# Altium schematic sheet Connectors.SchDoc
size A4; SheetNumber: 3; SheetTotal: 4
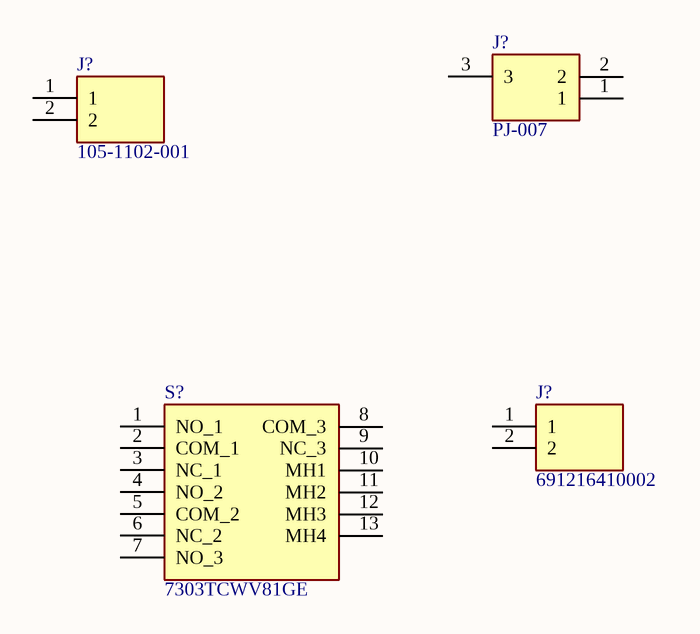
[diagram p0: Connectors.SchDoc]

## Parts
(Parts that share a designator on the sheet are numbered #1, #2 ... from top to bottom, then left to right.)
J?#1  PJ-007  [PJ007]
J?#2  105-1102-001  [1051102001]
J?#3  691216410002  [691216410002]
S?  7303TCWV81GE  [7303TCWV81GE]

## Nets

Not connected (* = marked no-connect by the designer): J?#1 1 2 3; J?#2 1 2; J?#3 1 2; S? 1(NO_1) 2(COM_1) 3(NC_1) 4(NO_2) 5(COM_2) 6(NC_2) 7(NO_3) 8(COM_3) 9(NC_3) 10(MH1) 11(MH2) 12(MH3) 13(MH4)

## Library data of the parts
J?#1 = PJ-007: Connector; Manufacturer_Name: Same Sky; Datasheet Link: https://www.sameskydevices.com/product/resource/supplyframepdf/pj-007.pdf; Height: 7.6mm; Manufacturer_Part_Number: PJ-007; Mouser Part Number: 490-PJ-007; Mouser Price/Stock: https://www.mouser.co.uk/ProductDetail/CUI-Devices/PJ-007?qs=WyjlAZoYn52tkNApkXGfYg%3D%3D; Arrow Part Number: PJ-007; Arrow Price/Stock: https://www.arrow.com/en/products/pj-007/cui-devices?region=nac
J?#2 = 105-1102-001: Connector; Manufacturer_Name: Cinch Connectivity Solutions; Datasheet Link: https://www.mouser.com/datasheet/2/643/pi-CCS-JOHN-105-1102-001-1289590.pdf; Height: 5.16mm; Manufacturer_Part_Number: 105-1102-001; Mouser Part Number: 530-105-1102-1; Mouser Price/Stock: https://www.mouser.co.uk/ProductDetail/Johnson-Cinch-Connectivity-Solutions/105-1102-001?qs=ALatB1zlu3CDNmlfAzCZwg%3D%3D; Arrow Part Number: 105-1102-001; Arrow Price/Stock: https://www.arrow.com/en/products/105-1102-001/cinch-connectivity-solutions?region=nac
J?#3 = 691216410002: Connector; Manufacturer_Name: Wurth Elektronik; Datasheet Link: https://docs.rs-online.com/7a5e/0900766b81734209.pdf; Height: 13.9mm; Manufacturer_Part_Number: 691216410002; Mouser Part Number: 710-691216410002; Mouser Price/Stock: https://www.mouser.co.uk/ProductDetail/Wurth-Elektronik/691216410002?qs=lBTPRtX1sU%2F93qGihT%252BGAQ%3D%3D
S? = 7303TCWV81GE: Switch; Manufacturer_Name: C & K COMPONENTS; Datasheet Link: https://www.ckswitches.com/media/1394/7000toggle.pdf; Height: 38.18mm; Manufacturer_Part_Number: 7303TCWV81GE; Arrow Part Number: 7303TCWV81GE; Arrow Price/Stock: https://www.arrow.com/en/products/7303tcwv81ge/ck